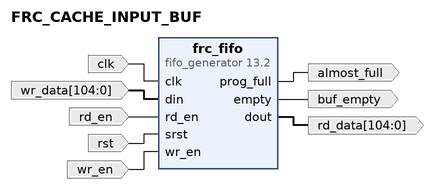
[diagram p0: block diagram of the top level]
# Vivado block design FRC_CACHE_INPUT_BUF, xcu280-fsvh2892-2L-e, Vivado 2021.2
create_bd_design FRC_CACHE_INPUT_BUF

create_bd_port -dir O almost_full
create_bd_port -dir O buf_empty
create_bd_port -dir I -type clk clk
create_bd_port -dir O -from 104 -to 0 rd_data
create_bd_port -dir I rd_en
create_bd_port -dir I rst
create_bd_port -dir I -from 104 -to 0 wr_data
create_bd_port -dir I wr_en

create_bd_cell -type ip -vlnv xilinx.com:ip:fifo_generator:13.2 frc_fifo
set_property -dict [list \
  CONFIG.Full_Threshold_Assert_Value 500 \
  CONFIG.Input_Data_Width 105 \
  CONFIG.Input_Depth 512 \
  CONFIG.Performance_Options First_Word_Fall_Through \
  CONFIG.Programmable_Full_Type Single_Programmable_Full_Threshold_Constant \
  CONFIG.Use_Embedded_Registers true \
] [get_bd_cells frc_fifo]

# ---- connections ----

connect_bd_net -net clk_0_1 [get_bd_ports clk] [get_bd_pins frc_fifo/clk]
connect_bd_net -net din_0_1 [get_bd_ports wr_data] [get_bd_pins frc_fifo/din]
connect_bd_net -net home_frc_fifo_dout [get_bd_pins frc_fifo/dout] [get_bd_ports rd_data]
connect_bd_net -net home_frc_fifo_empty [get_bd_pins frc_fifo/empty] [get_bd_ports buf_empty]
connect_bd_net -net home_frc_fifo_prog_full [get_bd_pins frc_fifo/prog_full] [get_bd_ports almost_full]
connect_bd_net -net rd_en_0_1 [get_bd_ports rd_en] [get_bd_pins frc_fifo/rd_en]
connect_bd_net -net srst_0_1 [get_bd_ports rst] [get_bd_pins frc_fifo/srst]
connect_bd_net -net wr_en_1_1 [get_bd_ports wr_en] [get_bd_pins frc_fifo/wr_en]

validate_bd_design
save_bd_design
